# Altium schematic sheet PushPullAmplifier.SchDoc
size A; SheetNumber: 1; SheetTotal: 2
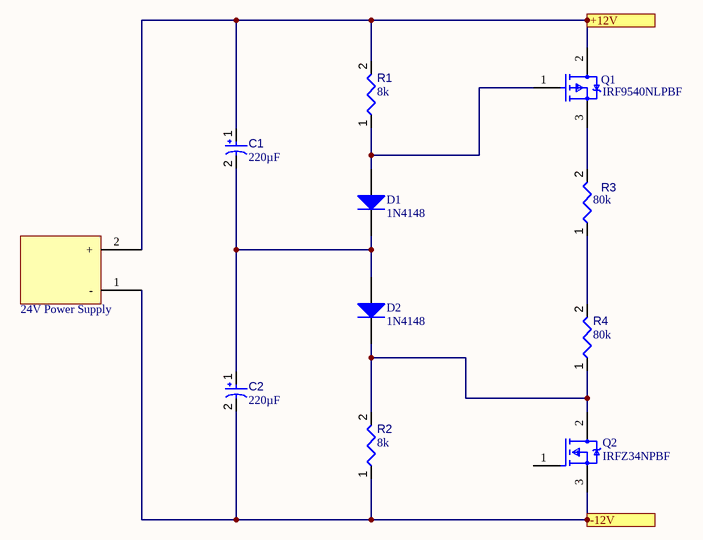
[diagram p0: PushPullAmplifier.SchDoc]

## Parts
C1  value 220µF  [CAPMP7344X31-T_V]  (hidden comment: TPSD227K010R0150)
C2  value 220µF  [CAPMP7344X31-T_V]  (hidden comment: TPSD227K010R0150)
D1  1N4148  [NXP-SOD27-2_V]
D2  1N4148  [NXP-SOD27-2_V]
Q1  IRF9540NLPBF  [FP-PG-TO262-3-MFG]
Q2  IRFZ34NPBF  [FP-PG-TO220-3-MFG]
R1  value 8k  [RESC2013X50X35ML15T15]  (hidden comment: Resistor 10k +/-1% 0805 125 mW)
R2  value 8k  [RESC2013X50X35ML15T15]  (hidden comment: Resistor 10k +/-1% 0805 125 mW)
R3  value 80k  [RESC2013X50X35ML15T15]  (hidden comment: Resistor 10k +/-1% 0805 125 mW)
R4  value 80k  [RESC2013X50X35ML15T15]  (hidden comment: Resistor 10k +/-1% 0805 125 mW)
U?  24V Power Supply  [AMTC-AME15-MAZ]

## Ports
+12V, -12V

## Nets
+12V: C1.1 Q1.2(Drain) R1.2 U?.2(+) ; port +12V
-12V: C2.2 Q2.3(SOURCE) R2.1 U?.1(-) ; port -12V
NetC1_2: C1.2 C2.1 D1.2(K) D2.1(A)
NetD1_1: D1.1(A) Q1.1(Gate) R1.1
NetD2_2: D2.2(K) Q2.2(DRAIN) R2.2 R4.1
NetQ1_3: Q1.3(Source) R3.2
NetR3_1: R3.1 R4.2

Not connected (* = marked no-connect by the designer): Q2 1(GATE)

## Library data of the parts
C1 C2 = CMP-001-00051-7: Tantalum Capacitor, 220 uF, +/- 10%, 10 V, -55 to 125 degC, 2917 (7343 Metric), RoHS, Tape and Reel; Manufacturer: AVX Corporation; Voltage Rating: 10V; Case/Package: 2917; Datasheet URL: https://datasheet.ciiva.com/8080/1680477-8080379.pdf; Package Description: 2-Pin Surface Mount Device, Body 7.3 x 4.35 mm; Tolerance: 10%; RoHS Compliant: True; Capacitor Type: Tantalum; Manufacturer URL: http://www.avx.com/; Pins: 2; Package Quantity: 1; Max Operating Temperature: 125°C; Mounting Technology: SM; Packaging: TapeandReel; Datasheet Version: 42736; Package Reference: 7343-31; Min Operating Temperature: -55°C
D1 D2 = CMP-004-00000-2: High Speed Diode, 100 V, 0.45 A, -65 to 175 degC, 2-Pin SOD27, RoHS, Bulk; Manufacturer: Fairchild; Elements: 1; Recovery Time: 4ns; Forward Current: 300mA; Power: 500mW; Forward Voltage: 1V; Max Surge Current: 4A; Peak Reverse Current: 5uA; Datasheet URL: http://www.nxp.com/documents/data_sheet/1N4148_1N4448.pdf; Min Operating Temperature: -65°C; Manufacturer URL: https://www.fairchildsemi.com/; Packaging: Bulk; Diameter: 1.91mm; Pins: 2; Package URL: http://www.nxp.com/documents/data_sheet/1N4148_1N4448.pdf; Package Reference: SOD27; Max Operating Temperature: 175°C; Package Quantity: 2000; Case/Package: DO; Datasheet Version: Aug-04; RoHS Compliant: True
Q1 = CMP-32901-000518-1: MOSFET P-CH 100V 23A TO262-3; Number of Channels: 1; Max Dual Supply Voltage: -100V; Rise Time: 67ns; Max Power Dissipation: 3.1W; Gate to Source Voltage (Vgs): 20V; Drain to Source Resistance: 117mR; Turn-On Delay Time: 13ns; Turn-Off Delay Time: 40ns; Threshold Voltage: 4V; Input Capacitance: 1.45nF; Power Dissipation: 110W; Length: 0.42inch; Max Operating Temperature: 150°C; Case/Package: TO-262; Packaging: Rail/Tube; Height: 0.38inch; Drain to Source Voltage (Vdss): -100V; Lead Free: Contains Lead; Rds On Max: 117mR; Width: 0.19inch; Min Operating Temperature: -55°C; RoHS Compliant: Yes; Mount: Through Hole; Continuous Drain Current (ID): 23A; Number of Pins: 3; Halogen Free: Not Halogen Free; REACH SVHC: No SVHC
Q2 = CMP-32901-000547-1: MOSFET N-CH 55V 29A TO220AB; Rise Time: 49ns; Turn-On Delay Time: 7ns; Input Capacitance: 700pF; Drain to Source Resistance: 40mR; Turn-Off Delay Time: 31ns; Power Dissipation: 68W; Gate to Source Voltage (Vgs): 20V; Element Configuration: Single; Threshold Voltage: 4V; Packaging: Rail/Tube; Number of Pins: 3; Height: 0.6inch; Case/Package: TO-220; Min Operating Temperature: -55°C; Max Operating Temperature: 175°C; RoHS Compliant: Yes; Width: 0.185inch; Lead Free: Lead Free; Contact Plating: Tin; Drain to Source Breakdown Voltage: 55V; Length: 0.414inch; Mount: Through Hole; Max Power Dissipation: 68W; Halogen Free: Not Halogen Free; Max Dual Supply Voltage: 55V; Rds On Max: 40mR; Continuous Drain Current (ID): 29A; Drain to Source Voltage (Vdss): 55V; REACH SVHC: No SVHC
R1-R4 = CMP-009-00018-5: Chip Resistor, 10 KOhm, +/- 1%, 125 mW, -55 to 155 degC, 0805 (2012 Metric); Power: 125mW; Voltage Rating: 150V; Tolerance: 1%; Pins: 2; Min Operating Temperature: -55°C; Case/Package: 0805; Max Operating Temperature: 155°C; RoHS Compliant: True; Mounting Technology: SM
U? = CMP-2000-07538-1: AC-DC / DC-DC Converter, 15 W, 24 V, 0.63 A, -40 to 85 degC, 6-Pin THD, RoHS; Manufacturer: Aimtec; Max Output Power: 15W; Case\/Package: DIP; Max Current Rating: 350mA; Number of Outputs: 1; Max Output Current: 630mA; Efficiency: 84%; Package Description: 6-Pin Through Hole Device, Body 65 x 46.5 mm, Pitch 10 mm; Datasheet Version: 07/2016; Max Operating Temperature: 85degC; Mounting Technology: ThroughHole; Manufacturer URL: http://www.aimtec.com/; Package Reference: AME15-MAZ; RoHSCompliant: true; Datasheet URL: https://www.google.com.hk/url?sa=t&rct=j&q=&esrc=s&source=web&cd=1&ved=0ahUKEwj5n73ZsMfWAhXFXbwKHXo5CuUQFggkMAA&url=http%3A%2F%2Fwww.aimtec.com%2Fsite%2FAimtec%2Ffiles%2FDatasheet%2FHighResolution%2FAME15-MAZ.pdf&usg=AFQjCNESjzRlryhEWeRV9RbYXVM_OPFdnw; Min Operating Temperature: -40degC; Output Voltage: 24V